# EAGLE design SNES_to_NES (EAGLE 6.6.0)
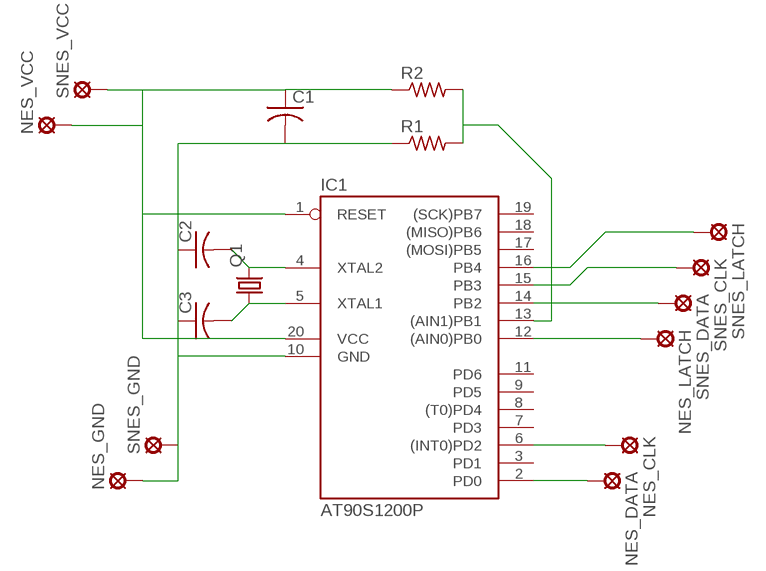
[diagram p0: schematic, sheet 1]

## Parts
C1  C-US025_050-035X075  [C025_050-035X075]
C2  C-US025-030X050  [C025-030X050]
C3  C-US025-030X050  [C025-030X050]
IC1  AT90S1200P  [DIL20]
NES_CLK  MCS08  [MCS08]
NES_DATA  MCS08  [MCS08]
NES_GND  MCS08  [MCS08]
NES_LATCH  MCS08  [MCS08]
NES_VCC  MCS08  [MCS08]
Q1  CRYSTALHC49U-H  [HC49U-H]
R1  R-US_0207/7  [0207/7]
R2  R-US_0207/7  [0207/7]
SNES_CLK  MCS08  [MCS08]
SNES_DATA  MCS08  [MCS08]
SNES_GND  MCS08  [MCS08]
SNES_LATCH  MCS08  [MCS08]
SNES_VCC  MCS08  [MCS08]

## Nets
GND: C1.2 C2.1 C3.1 IC1.10(GND) NES_GND.MP R1.1 SNES_GND.MP
N$2: C1.1 IC1.1(RESET) IC1.20(VCC) NES_VCC.MP R2.1 SNES_VCC.MP
N$3: IC1.15(PB3) SNES_CLK.MP
N$4: C3.2 IC1.5(XTAL1) Q1.1
N$5: C2.2 IC1.4(XTAL2) Q1.2
N$6: IC1.13((AIN1)PB1) R1.2 R2.2
N$7: IC1.16(PB4) SNES_LATCH.MP
N$8: IC1.12((AIN0)PB0) NES_LATCH.MP
N$9: IC1.14(PB2) SNES_DATA.MP
N$10: IC1.2(PD0) NES_DATA.MP
N$11: IC1.6((INT0)PD2) NES_CLK.MP
Unconnected: IC1.3(PD1) IC1.7(PD3) IC1.8((T0)PD4) IC1.9(PD5) IC1.11(PD6) IC1.17((MOSI)PB5) IC1.18((MISO)PB6) IC1.19((SCK)PB7)

## Library data of the parts
C1-C3 = rcl:C-US: CAPACITOR, American symbol
IC1 = atmel:AT90S1200: MICROCONTROLLER 1 Kbytes FLASH 64 bytes EEPROM; OC_FARNELL: unknown; OC_NEWARK: unknown
NES_CLK NES_DATA NES_GND NES_LATCH NES_VCC SNES_CLK SNES_DATA SNES_GND SNES_LATCH SNES_VCC = solpad:MCS08: SOLDER PAD MC S0,8, drill 1.2 mm, distributor Buerklin, 08F130
Q1 = crystal:CRYSTAL: CRYSTAL; OC_FARNELL: 1666973; OC_NEWARK: unknown
R1 R2 = rcl:R-US_: RESISTOR, American symbol

## Board
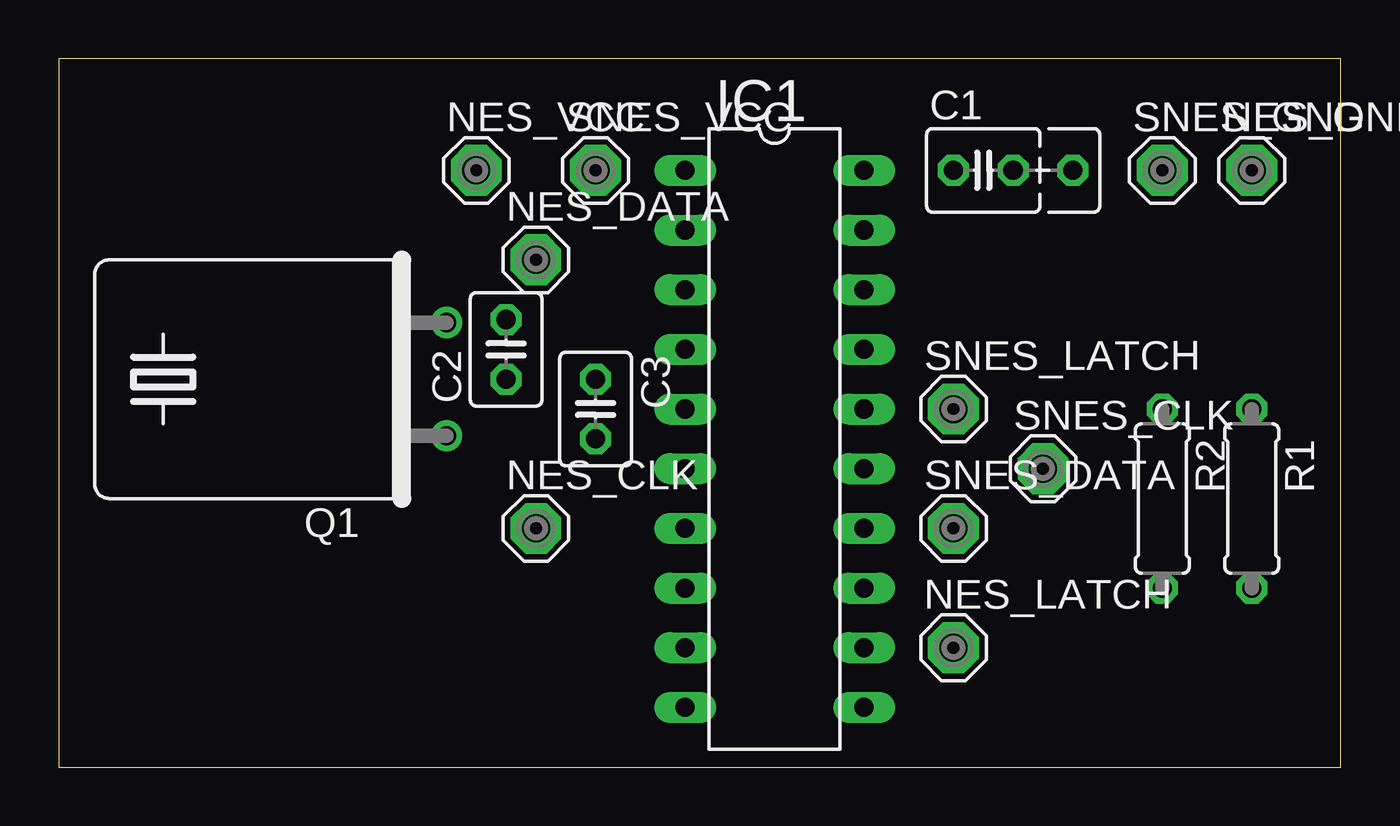
[diagram p1: board, top side]
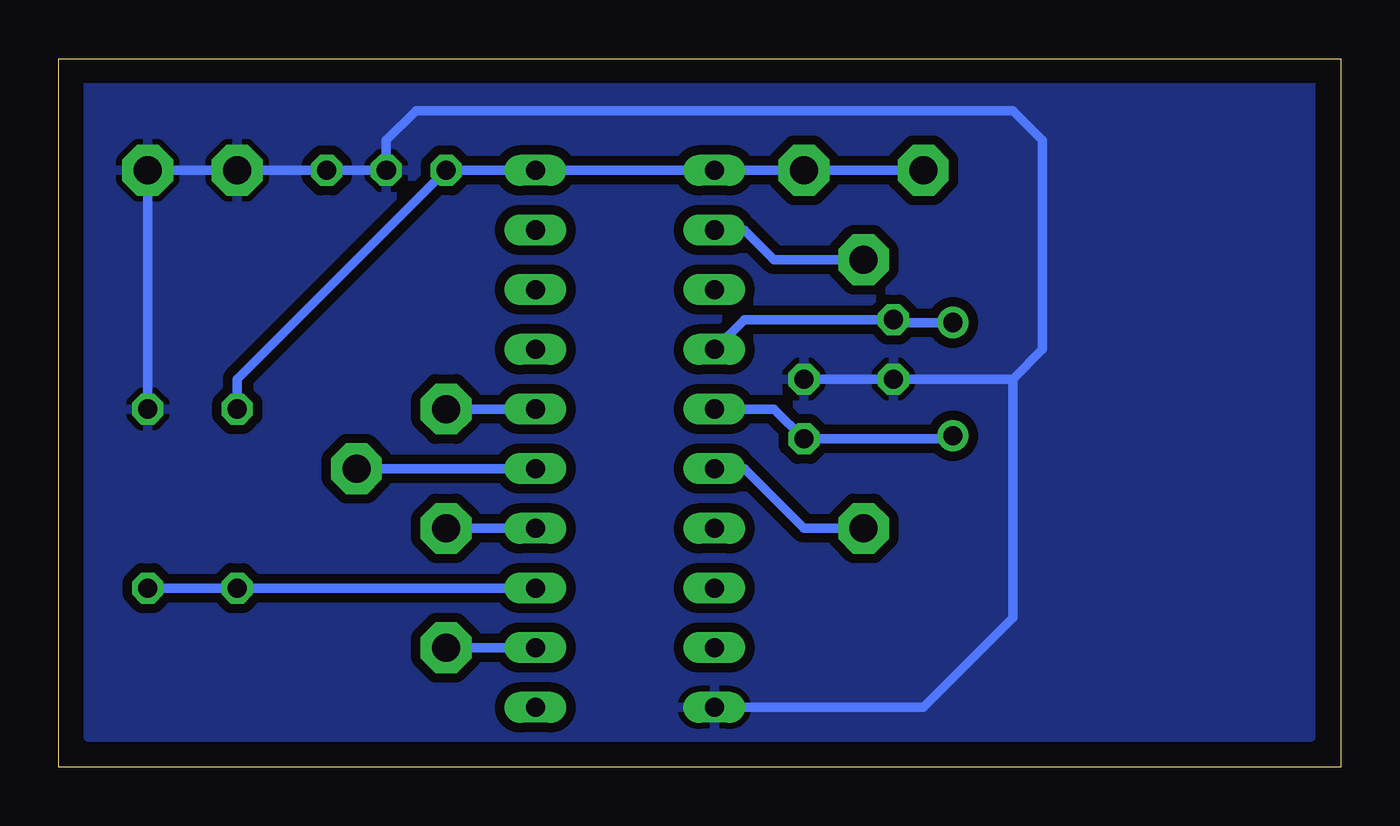
[diagram p2: board, bottom side, seen from below]

Size 54.59 x 30.15 mm. Coordinates in mm from the lower left corner, seen from the top.
Outline: 0,0 54.59,0 54.59,30.15 0,30.15 0,0
Copper layers (1*16): Top 0.035mm / dielectric 1.5mm / Bottom 0.035mm
Design rules "default": minimum track width 10mil, minimum drill 24mil, track to track 8mil, track to pad 8mil, pad to pad 8mil, via to via 8mil, smd to smd 8mil, copper to edge 40mil, drill to drill 8mil, minimum pad ring 10mil, minimum via ring 8mil, stop-mask expansion 4mil, vias tented up to drill 0mil, thermal gap 10mil

### Footprints (pad centres in the part's own frame; a part is rotated, then mirrored left to right if it is on the bottom)
C025_050-035X075 = drill 0.813 octagon: 1 -1.27,0; 2 1.27,0; 3 3.81,0
C025-030X050 = drill 0.813 octagon: 1 -1.27,0; 2 1.27,0
DIL20 = drill 0.813 long: 1 -11.43,-3.81; 2 -8.89,-3.81; 3 -6.35,-3.81; 4 -3.81,-3.81; 5 -1.27,-3.81; 6 1.27,-3.81; 7 3.81,-3.81; 8 6.35,-3.81; 9 8.89,-3.81; 10 11.43,-3.81; 11 11.43,3.81; 12 8.89,3.81; 13 6.35,3.81; 14 3.81,3.81; 15 1.27,3.81; 16 -1.27,3.81; 17 -3.81,3.81; 18 -6.35,3.81; 19 -8.89,3.81; 20 -11.43,3.81
MCS08 = drill 1.194 pad 2.159 octagon: MP 0,0
HC49U-H = drill 0.813: 1 -2.413,-5.08; 2 2.413,-5.08
0207/7 = drill 0.813 octagon: 1 -3.81,0; 2 3.81,0

### Placement (x,y rotation side)
C1  39.37,25.4 0 top
C2  19.05,17.78 90 top
C3  22.86,15.24 270 top
IC1  30.48,13.97 270 top
NES_CLK  20.32,10.16 0 top
NES_DATA  20.32,21.59 0 top
NES_GND  50.8,25.4 0 top
NES_LATCH  38.1,5.08 0 top
NES_VCC  17.78,25.4 0 top
Q1  11.43,16.51 90 top
R1  50.8,11.43 270 top
R2  46.99,11.43 270 top
SNES_CLK  41.91,12.7 0 top
SNES_DATA  38.1,10.16 0 top
SNES_GND  46.99,25.4 0 top
SNES_LATCH  38.1,15.24 0 top
SNES_VCC  22.86,25.4 0 top

### Tracks (layer width: path | path; a pad name or v marks a point on that pad's centre or on a via)
GND
  Bottom 0.406: 13.97,16.51 12.7,17.78 12.7,26.67 13.97,27.94 39.37,27.94 40.64,26.67 C1.2 SNES_GND.MP NES_GND.MP R1.1 | 13.97,16.51 C2.1 C3.1 | IC1.10 17.78,2.54 13.97,6.35 13.97,16.51
  pour Bottom (isolate 0.406): 1.27,1.27 53.34,1.27 53.34,29.21 1.27,29.21
N$2
  Bottom 0.406: NES_VCC.MP SNES_VCC.MP IC1.1 IC1.20 C1.1 46.99,16.51 R2.1
N$3
  Bottom 0.406: IC1.15 SNES_CLK.MP
N$4
  Bottom 0.406: IC1.5 24.13,15.24 C3.2 16.64,13.97 Q1.1
N$5
  Bottom 0.406: IC1.4 25.4,19.05 C2.2 18.92,18.92 Q1.2
N$6
  Bottom 0.406: IC1.13 R2.2 R1.2
N$7
  Bottom 0.406: IC1.16 SNES_LATCH.MP
N$8
  Bottom 0.406: NES_LATCH.MP IC1.12
N$9
  Bottom 0.406: IC1.14 SNES_DATA.MP
N$10
  Bottom 0.406: NES_DATA.MP 24.13,21.59 25.4,22.86 IC1.2
N$11
  Bottom 0.406: NES_CLK.MP 22.86,10.16 25.4,12.7 IC1.6